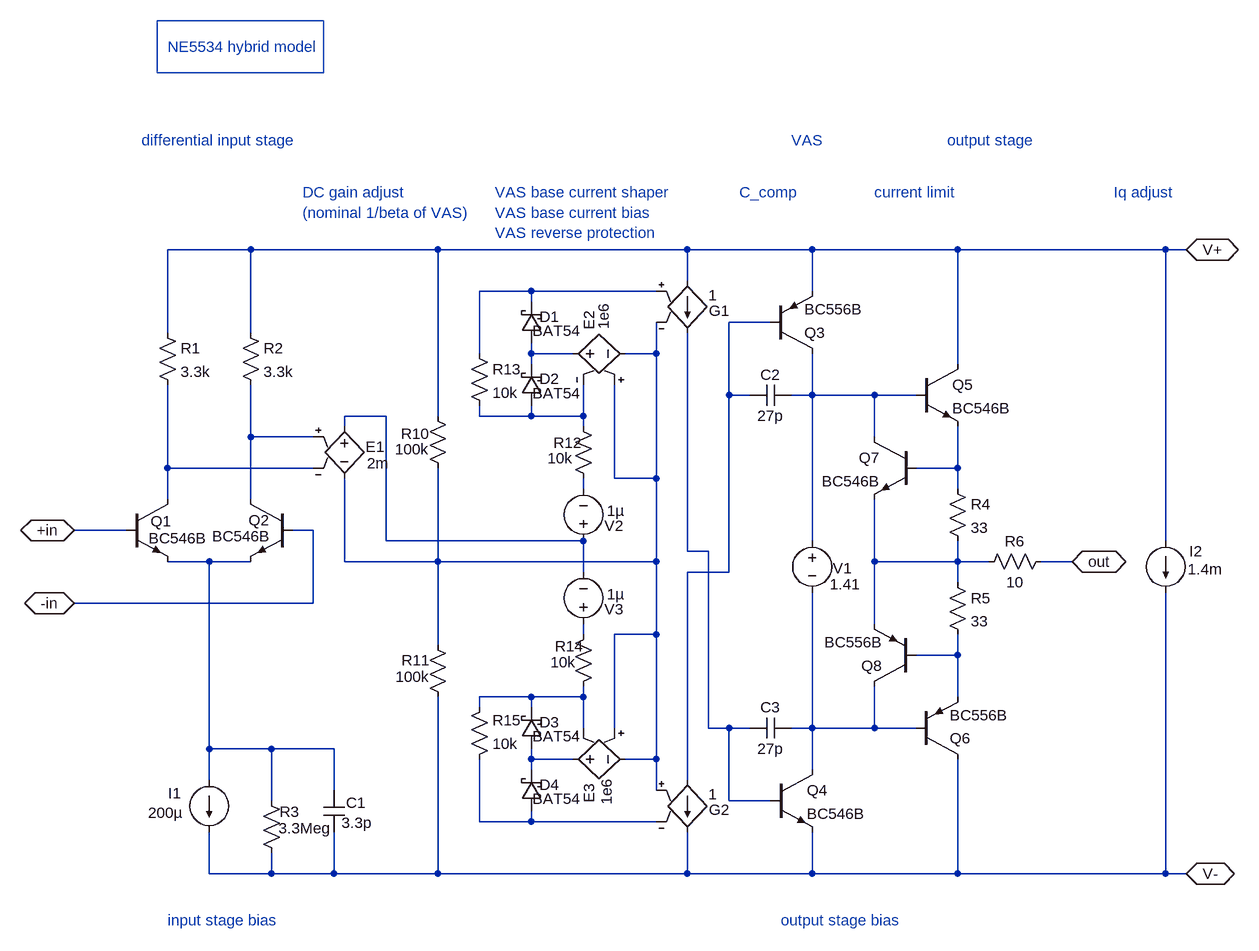
[diagram p0: schematic NE5534_h1.asc]
NE5534_h1.asc, the LTspice schematic file:
Version 4
SHEET 1 1224 756
WIRE -416 -480 -544 -480
WIRE -128 -480 -416 -480
WIRE 256 -480 -128 -480
WIRE 448 -480 256 -480
WIRE 672 -480 448 -480
WIRE 992 -480 672 -480
WIRE 1024 -480 992 -480
WIRE 256 -432 256 -480
WIRE 16 -416 -64 -416
WIRE 208 -416 16 -416
WIRE 448 -416 448 -480
WIRE 16 -400 16 -416
WIRE 384 -368 320 -368
WIRE -544 -352 -544 -480
WIRE -416 -352 -416 -480
WIRE -64 -320 -64 -416
WIRE 16 -320 16 -336
WIRE 80 -320 16 -320
WIRE 208 -320 208 -368
WIRE 208 -320 160 -320
WIRE 16 -304 16 -320
WIRE 672 -304 672 -480
WIRE 320 -256 320 -368
WIRE 352 -256 320 -256
WIRE 448 -256 448 -320
WIRE 448 -256 416 -256
WIRE 544 -256 448 -256
WIRE 608 -256 544 -256
WIRE -208 -224 -272 -224
WIRE -128 -224 -128 -480
WIRE -64 -224 -64 -240
WIRE 16 -224 16 -240
WIRE 16 -224 -64 -224
WIRE 96 -224 96 -272
WIRE 96 -224 16 -224
WIRE -272 -208 -272 -224
WIRE 96 -208 96 -224
WIRE -416 -192 -416 -272
WIRE -320 -192 -416 -192
WIRE 544 -192 544 -256
WIRE -544 -144 -544 -272
WIRE -320 -144 -544 -144
WIRE 672 -144 672 -208
WIRE 672 -144 608 -144
WIRE 144 -128 144 -272
WIRE 208 -128 208 -320
WIRE 208 -128 144 -128
WIRE 96 -112 96 -128
WIRE 672 -112 672 -144
WIRE -544 -96 -544 -144
WIRE -416 -96 -416 -192
WIRE -608 -48 -688 -48
WIRE -320 -48 -352 -48
WIRE -208 -32 -208 -224
WIRE 96 -32 -208 -32
WIRE 448 -32 448 -256
WIRE 992 -32 992 -480
WIRE 256 -16 256 -352
WIRE 288 -16 256 -16
WIRE -480 0 -544 0
WIRE -416 0 -480 0
WIRE -272 0 -272 -128
WIRE -128 0 -128 -144
WIRE -128 0 -272 0
WIRE 208 0 208 -128
WIRE 208 0 -128 0
WIRE 544 0 544 -96
WIRE 672 0 672 -32
WIRE 672 0 544 0
WIRE 720 0 672 0
WIRE 848 0 800 0
WIRE 96 16 96 -32
WIRE 320 16 320 -256
WIRE 320 16 256 16
WIRE 672 32 672 0
WIRE -320 64 -320 -48
WIRE -320 64 -688 64
WIRE 544 96 544 0
WIRE 96 112 96 96
WIRE 208 112 208 0
WIRE 208 112 144 112
WIRE -128 128 -128 0
WIRE 672 144 672 112
WIRE 672 144 608 144
WIRE 16 208 -64 208
WIRE 96 208 96 192
WIRE 96 208 16 208
WIRE 672 208 672 144
WIRE -64 224 -64 208
WIRE 16 224 16 208
WIRE 96 256 96 208
WIRE 144 256 144 112
WIRE 288 256 288 -16
WIRE 320 256 288 256
WIRE 352 256 320 256
WIRE 448 256 448 48
WIRE 448 256 416 256
WIRE 544 256 544 192
WIRE 544 256 448 256
WIRE 608 256 544 256
WIRE -480 288 -480 0
WIRE -384 288 -480 288
WIRE -288 288 -384 288
WIRE 16 304 16 288
WIRE 80 304 16 304
WIRE 208 304 208 112
WIRE 208 304 160 304
WIRE 16 320 16 304
WIRE 448 320 448 256
WIRE -480 336 -480 288
WIRE 256 336 256 16
WIRE -288 352 -288 288
WIRE 208 352 208 304
WIRE -384 368 -384 288
WIRE 320 368 320 256
WIRE 384 368 320 368
WIRE -64 400 -64 304
WIRE 16 400 16 384
WIRE 16 400 -64 400
WIRE 208 400 16 400
WIRE -480 480 -480 416
WIRE -384 480 -384 448
WIRE -384 480 -480 480
WIRE -288 480 -288 416
WIRE -288 480 -384 480
WIRE -128 480 -128 208
WIRE -128 480 -288 480
WIRE 256 480 256 416
WIRE 256 480 -128 480
WIRE 448 480 448 416
WIRE 448 480 256 480
WIRE 672 480 672 304
WIRE 672 480 448 480
WIRE 992 480 992 48
WIRE 992 480 672 480
WIRE 1024 480 992 480
FLAG -688 -48 +in
IOPIN -688 -48 BiDir
FLAG -688 64 -in
IOPIN -688 64 BiDir
FLAG 848 0 out
IOPIN 848 0 BiDir
FLAG 1024 -480 V+
IOPIN 1024 -480 BiDir
FLAG 1024 480 V-
IOPIN 1024 480 BiDir
SYMBOL npn 608 -304 R0
SYMATTR InstName Q5
SYMATTR Value BC546B
SYMBOL pnp 608 304 M180
WINDOW 0 52 32 Left 0
WINDOW 3 52 68 Left 0
SYMATTR InstName Q6
SYMATTR Value BC556B
SYMBOL npn 608 -192 M0
SYMATTR InstName Q7
SYMATTR Value BC546B
SYMBOL pnp 608 192 R180
WINDOW 0 52 32 Left 0
WINDOW 3 52 68 Left 0
SYMATTR InstName Q8
SYMATTR Value BC556B
SYMBOL res 656 -128 R0
SYMATTR InstName R4
SYMATTR Value 33
SYMBOL res 656 16 R0
SYMATTR InstName R5
SYMATTR Value 33
SYMBOL res 816 -16 R90
WINDOW 0 0 56 VBottom 0
WINDOW 3 32 56 VTop 0
SYMATTR InstName R6
SYMATTR Value 10
SYMBOL voltage 448 -48 R0
WINDOW 0 32 58 Left 0
WINDOW 3 27 83 Left 0
WINDOW 123 0 0 Left 0
WINDOW 39 0 0 Left 0
SYMATTR InstName V1
SYMATTR Value 1.41
SYMBOL e2 64 -320 R270
WINDOW 0 37 41 Left 0
WINDOW 3 37 63 Left 0
SYMATTR InstName E2
SYMATTR Value 1e6
SYMBOL res 80 -224 R0
WINDOW 0 -30 41 Left 0
WINDOW 3 -39 65 Left 0
SYMATTR InstName R12
SYMATTR Value 10k
SYMBOL res -80 -336 R0
SYMATTR InstName R13
SYMATTR Value 10k
SYMBOL e2 64 304 M90
WINDOW 0 38 41 Left 0
WINDOW 3 30 68 Left 0
SYMATTR InstName E3
SYMATTR Value 1e6
SYMBOL res 80 208 M180
WINDOW 0 -28 78 Left 0
WINDOW 3 -35 53 Left 0
SYMATTR InstName R14
SYMATTR Value 10k
SYMBOL res -80 320 M180
WINDOW 0 36 76 Left 0
WINDOW 3 36 40 Left 0
SYMATTR InstName R15
SYMATTR Value 10k
SYMBOL res -144 -240 R0
WINDOW 0 -41 43 Left 0
WINDOW 3 -50 67 Left 0
SYMATTR InstName R10
SYMATTR Value 100k
SYMBOL res -144 112 R0
WINDOW 0 -40 40 Left 0
WINDOW 3 -49 65 Left 0
SYMATTR InstName R11
SYMATTR Value 100k
SYMBOL npn -352 -96 M0
WINDOW 0 35 32 Left 0
WINDOW 3 34 57 Left 0
SYMATTR InstName Q2
SYMATTR Value BC546B
SYMBOL res -560 -368 R0
SYMATTR InstName R1
SYMATTR Value 3.3k
SYMBOL res -432 -368 R0
SYMATTR InstName R2
SYMATTR Value 3.3k
SYMBOL current -480 336 R0
WINDOW 0 -63 20 Left 0
WINDOW 3 -94 50 Left 0
WINDOW 123 0 0 Left 0
WINDOW 39 0 0 Left 0
SYMATTR InstName I1
SYMATTR Value 200µ
SYMBOL npn -608 -96 R0
WINDOW 0 38 34 Left 0
WINDOW 3 35 60 Left 0
SYMATTR InstName Q1
SYMATTR Value BC546B
SYMBOL e -272 -224 R0
WINDOW 0 33 47 Left 0
WINDOW 3 35 73 Left 0
SYMATTR InstName E1
SYMATTR Value 2m
SYMBOL res -400 352 R0
WINDOW 0 28 33 Left 0
WINDOW 3 27 58 Left 0
SYMATTR InstName R3
SYMATTR Value 3.3Meg
SYMBOL cap -304 352 R0
WINDOW 0 35 19 Left 0
WINDOW 3 28 50 Left 0
SYMATTR InstName C1
SYMATTR Value 3.3p
SYMBOL npn 384 320 R0
SYMATTR InstName Q4
SYMATTR Value BC546B
SYMBOL pnp 384 -320 M180
WINDOW 0 52 32 Left 0
WINDOW 3 52 68 Left 0
SYMATTR InstName Q3
SYMATTR Value BC556B
SYMBOL cap 416 -272 R90
WINDOW 0 0 32 VBottom 0
WINDOW 3 32 32 VTop 0
SYMATTR InstName C2
SYMATTR Value 27p
SYMBOL cap 416 240 R90
WINDOW 0 0 32 VBottom 0
WINDOW 3 32 32 VTop 0
SYMATTR InstName C3
SYMATTR Value 27p
SYMBOL schottky 32 -336 R180
WINDOW 0 -27 41 Left 0
WINDOW 3 -59 19 Left 0
SYMATTR InstName D1
SYMATTR Value BAT54
SYMATTR Description Diode
SYMATTR Type diode
SYMBOL schottky 32 -240 R180
WINDOW 0 -27 41 Left 0
WINDOW 3 -59 19 Left 0
SYMATTR InstName D2
SYMATTR Value BAT54
SYMATTR Description Diode
SYMATTR Type diode
SYMBOL schottky 32 288 R180
WINDOW 0 -27 41 Left 0
WINDOW 3 -59 19 Left 0
SYMATTR InstName D3
SYMATTR Value BAT54
SYMATTR Description Diode
SYMATTR Type diode
SYMBOL schottky 32 384 R180
WINDOW 0 -27 41 Left 0
WINDOW 3 -59 19 Left 0
SYMATTR InstName D4
SYMATTR Value BAT54
SYMATTR Description Diode
SYMATTR Type diode
SYMBOL g2 256 432 M180
WINDOW 0 33 50 Left 0
WINDOW 3 32 74 Left 0
SYMATTR InstName G2
SYMATTR Value 1
SYMBOL g2 256 -336 M180
WINDOW 0 33 50 Left 0
WINDOW 3 32 74 Left 0
SYMATTR InstName G1
SYMATTR Value 1
SYMBOL voltage 96 -16 M180
WINDOW 0 32 39 Left 0
WINDOW 3 36 62 Left 0
WINDOW 123 0 0 Left 0
WINDOW 39 0 0 Left 0
SYMATTR InstName V2
SYMATTR Value 1µ
SYMBOL voltage 96 112 M180
WINDOW 0 32 39 Left 0
WINDOW 3 36 62 Left 0
WINDOW 123 0 0 Left 0
WINDOW 39 0 0 Left 0
SYMATTR InstName V3
SYMATTR Value 1µ
SYMBOL current 992 -32 R0
WINDOW 0 36 16 Left 0
WINDOW 3 34 44 Left 0
WINDOW 123 0 0 Left 0
WINDOW 39 0 0 Left 0
SYMATTR InstName I2
SYMATTR Value 1.4m
TEXT -584 -648 Left 0 ;differential input stage
TEXT -544 552 Left 0 ;input stage bias
TEXT -336 -568 Left 0 ;DC gain adjust\n(nominal 1/beta of VAS)
TEXT -40 -568 Left 0 ;VAS base current shaper\nVAS base current bias\nVAS reverse protection
TEXT 416 -648 Left 0 ;VAS
TEXT 336 -568 Left 0 ;C_comp
TEXT 656 -648 Left 0 ;output stage
TEXT 544 -568 Left 0 ;current limit
TEXT 912 -568 Left 0 ;Iq adjust
TEXT -544 -792 Left 0 ;NE5534 hybrid model
TEXT 400 552 Left 0 ;output stage bias
RECTANGLE Normal -304 -752 -560 -832

The netlist it stands for:
* NE5534_h1.asc
Q5 V+ N005 N010 0 BC546B
Q6 V- N018 N016 0 BC556B
Q7 N005 N010 N014 0 BC546B
Q8 N018 N016 N014 0 BC556B
R4 N010 N014 33
R5 N014 N016 33
R6 out N014 10
V1 N005 N018 1.41
E2 N003 N004 N004 N007 1e6
R12 N007 N011 10k
R13 N001 N007 10k
E3 N019 N004 N004 N017 1e6
R14 N017 N015 10k
R15 N020 N017 10k
R10 V+ N004 100k
R11 N004 V- 100k
Q2 N008 -in N013 0 BC546B
R1 V+ N009 3.3k
R2 V+ N008 3.3k
I1 N013 V- 200µ
Q1 N009 +in N013 0 BC546B
E1 N006 N004 N008 N009 2m
R3 N013 V- 3.3Meg
C1 N013 V- 3.3p
Q4 N018 N012 V- 0 BC546B
Q3 N005 N002 V+ 0 BC556B
C2 N005 N002 27p
C3 N018 N012 27p
D1 N003 N001 BAT54
D2 N007 N003 BAT54
D3 N019 N017 BAT54
D4 N020 N019 BAT54
G2 N002 V- N004 N020 1
G1 V+ N012 N001 N004 1
V2 N006 N011 1µ
V3 N015 N006 1µ
I2 V+ V- 1.4m
.model D D
.lib standard.dio
.model NPN NPN
.model PNP PNP
.lib standard.bjt
* differential input stage
* input stage bias
* DC gain adjust
* (nominal 1/beta of VAS)
* VAS base current shaper
* VAS base current bias
* VAS reverse protection
* VAS
* C_comp
* output stage
* current limit
* Iq adjust
* NE5534 hybrid model
* output stage bias
.backanno
.end